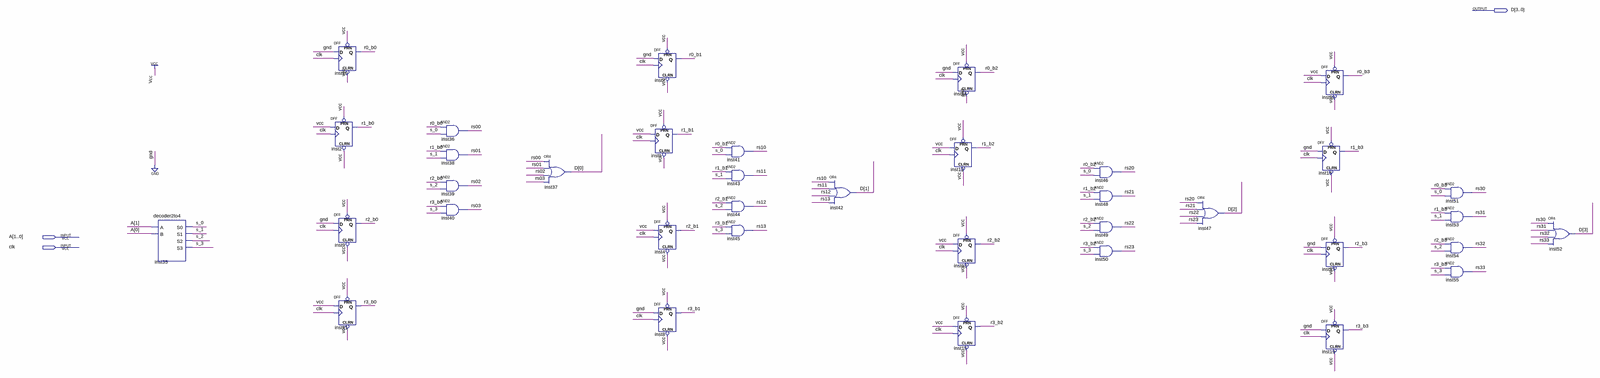
[diagram p0: schematic sheet, whole]
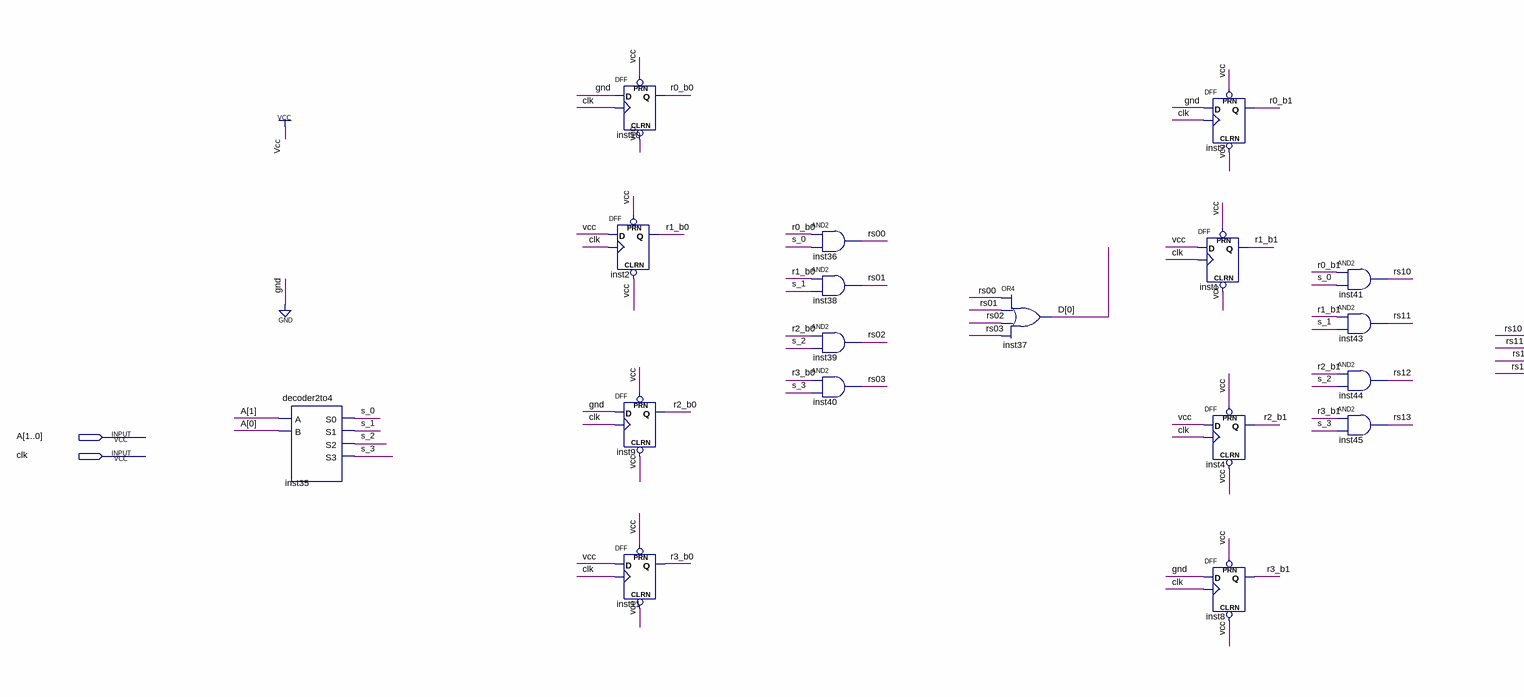
[diagram p1: schematic sheet, left part]
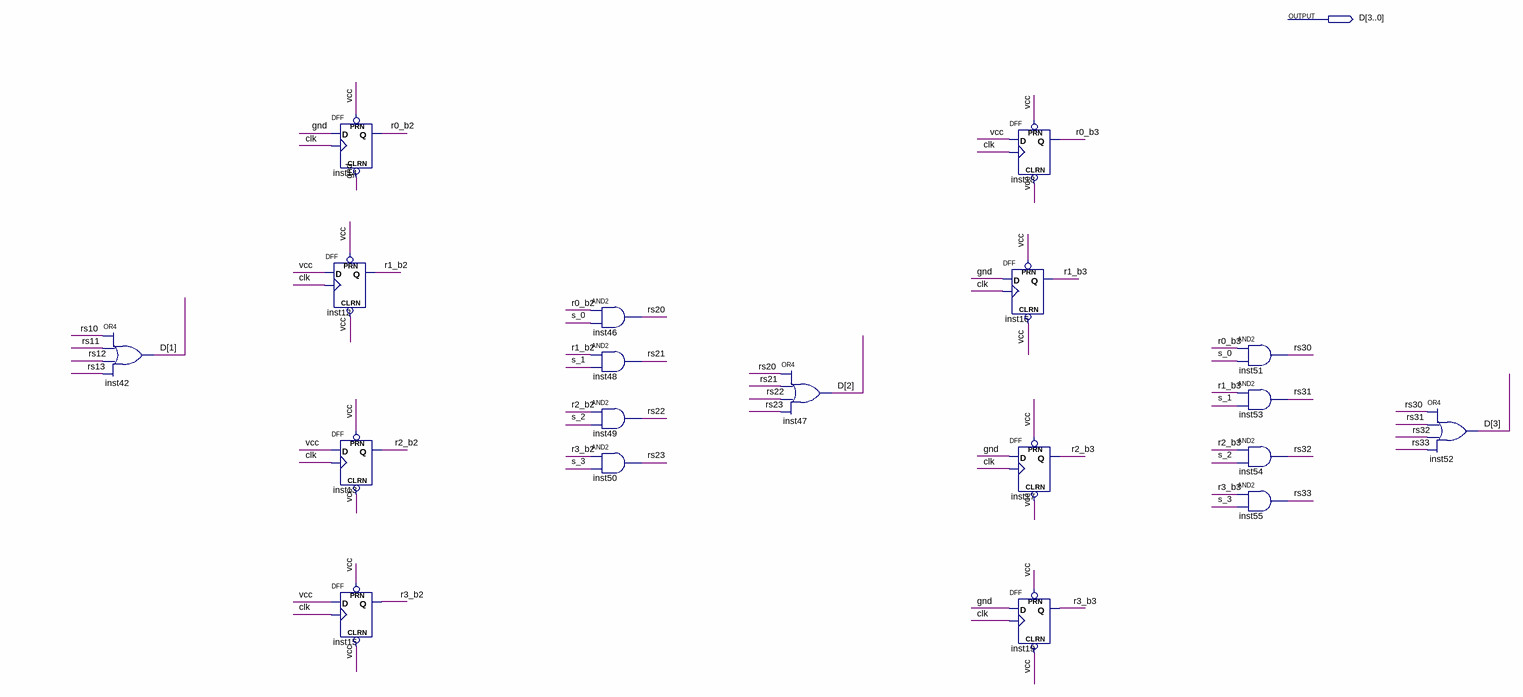
[diagram p2: schematic sheet, right part]
// Quartus schematic memoria.bdf as structural Verilog: 37 symbols, 3 pins
module memoria (
  input  [1:0] A,
  input  clk,
  output [3:0] D
);

  wire r0_b0, r0_b1, r0_b2, r0_b3, r1_b0, r1_b1, r1_b2, r1_b3, r2_b0, r2_b1, r2_b2, r2_b3, r3_b0, r3_b1,
       r3_b2, r3_b3, rs00, rs01, rs02, rs03, rs10, rs11, rs12, rs13, rs20, rs21, rs22, rs23, rs30, rs31,
       rs32, rs33, s_0, s_1, s_2, s_3;

  decoder2to4 inst35 (.A(A[1]), .B(A[0]), .S0(s_0), .S1(s_1), .S2(s_2), .S3(s_3));
  DFF inst10 (.CLRN(1'b1), .CLK(clk), .D(1'b0), .PRN(1'b1), .Q(r0_b0));
  DFF inst2 (.CLRN(1'b1), .CLK(clk), .D(1'b1), .PRN(1'b1), .Q(r1_b0));
  DFF inst9 (.CLRN(1'b1), .CLK(clk), .D(1'b0), .PRN(1'b1), .Q(r2_b0));
  DFF inst11 (.CLRN(1'b1), .CLK(clk), .D(1'b1), .PRN(1'b1), .Q(r3_b0));
  and inst36 (rs00, r0_b0, s_0);
  and inst38 (rs01, r1_b0, s_1);
  and inst39 (rs02, r2_b0, s_2);
  and inst40 (rs03, r3_b0, s_3);
  or inst37 (D[0], rs00, rs01, rs02, rs03);
  DFF inst7 (.CLRN(1'b1), .CLK(clk), .D(1'b0), .PRN(1'b1), .Q(r0_b1));
  DFF inst1 (.CLRN(1'b1), .CLK(clk), .D(1'b1), .PRN(1'b1), .Q(r1_b1));
  DFF inst4 (.CLRN(1'b1), .CLK(clk), .D(1'b1), .PRN(1'b1), .Q(r2_b1));
  DFF inst8 (.CLRN(1'b1), .CLK(clk), .D(1'b0), .PRN(1'b1), .Q(r3_b1));
  and inst41 (rs10, r0_b1, s_0);
  and inst43 (rs11, r1_b1, s_1);
  and inst44 (rs12, r2_b1, s_2);
  and inst45 (rs13, r3_b1, s_3);
  or inst42 (D[1], rs10, rs11, rs12, rs13);
  DFF inst14 (.CLRN(1'b0), .CLK(clk), .D(1'b0), .PRN(1'b1), .Q(r0_b2));
  DFF inst12 (.CLRN(1'b1), .CLK(clk), .D(1'b1), .PRN(1'b1), .Q(r1_b2));
  DFF inst13 (.CLRN(1'b1), .CLK(clk), .D(1'b1), .PRN(1'b1), .Q(r2_b2));
  DFF inst15 (.CLRN(1'b1), .CLK(clk), .D(1'b1), .PRN(1'b1), .Q(r3_b2));
  and inst46 (rs20, r0_b2, s_0);
  and inst48 (rs21, r1_b2, s_1);
  and inst49 (rs22, r2_b2, s_2);
  and inst50 (rs23, r3_b2, s_3);
  or inst47 (D[2], rs20, rs21, rs22, rs23);
  DFF inst18 (.CLRN(1'b1), .CLK(clk), .D(1'b1), .PRN(1'b1), .Q(r0_b3));
  DFF inst16 (.CLRN(1'b1), .CLK(clk), .D(1'b0), .PRN(1'b1), .Q(r1_b3));
  DFF inst17 (.CLRN(1'b1), .CLK(clk), .D(1'b0), .PRN(1'b1), .Q(r2_b3));
  DFF inst19 (.CLRN(1'b1), .CLK(clk), .D(1'b0), .PRN(1'b1), .Q(r3_b3));
  and inst51 (rs30, r0_b3, s_0);
  and inst53 (rs31, r1_b3, s_1);
  and inst54 (rs32, r2_b3, s_2);
  and inst55 (rs33, r3_b3, s_3);
  or inst52 (D[3], rs30, rs31, rs32, rs33);
endmodule
